# EAGLE schematic ext (EAGLE 9.6.1)
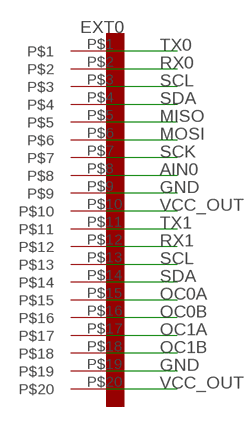
[diagram p0: schematic, sheet 1]

## Parts
EXT0  CON_DIL_20  [CON_DIL_20]

## Nets
AIN0: EXT0.P$8
GND: EXT0.P$9 EXT0.P$19
MISO: EXT0.P$5
MOSI: EXT0.P$6
OC0A: EXT0.P$15
OC0B: EXT0.P$16
OC1A: EXT0.P$17
OC1B: EXT0.P$18
RX0: EXT0.P$2
RX1: EXT0.P$12
SCK: EXT0.P$7
SCL: EXT0.P$3 EXT0.P$13
SDA: EXT0.P$4 EXT0.P$14
TX0: EXT0.P$1
TX1: EXT0.P$11
VCC_OUT: EXT0.P$10 EXT0.P$20

## Library data of the parts
EXT0 = connector:CON_DIL_20